# EAGLE design trackuino-icsp (EAGLE 5.08)
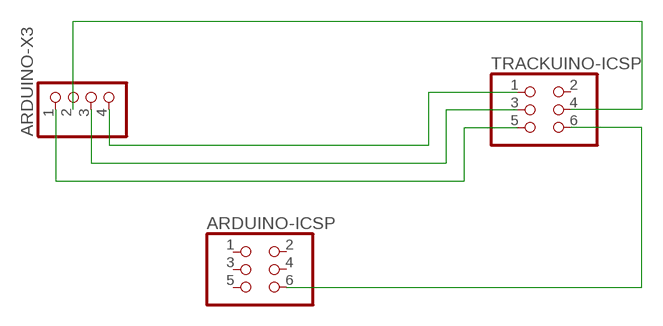
[diagram p0: schematic, sheet 1]

## Parts
ARDUINO-ICSP  PINHD-2X3  [2X03]
ARDUINO-X3  PINHD-1X4  [1X04]
TRACKUINO-ICSP  PINHD-2X3  [2X03]

## Nets
N$1: ARDUINO-X3.1 TRACKUINO-ICSP.5
N$2: ARDUINO-X3.2 TRACKUINO-ICSP.4
N$3: ARDUINO-X3.3 TRACKUINO-ICSP.3
N$4: ARDUINO-X3.4 TRACKUINO-ICSP.1
N$5: ARDUINO-ICSP.6 TRACKUINO-ICSP.6
Unconnected: ARDUINO-ICSP.1 ARDUINO-ICSP.2 ARDUINO-ICSP.3 ARDUINO-ICSP.4 ARDUINO-ICSP.5 TRACKUINO-ICSP.2

## Library data of the parts
ARDUINO-ICSP TRACKUINO-ICSP = pinhead:PINHD-2X3: PIN HEADER
ARDUINO-X3 = pinhead:PINHD-1X4: PIN HEADER

## Board
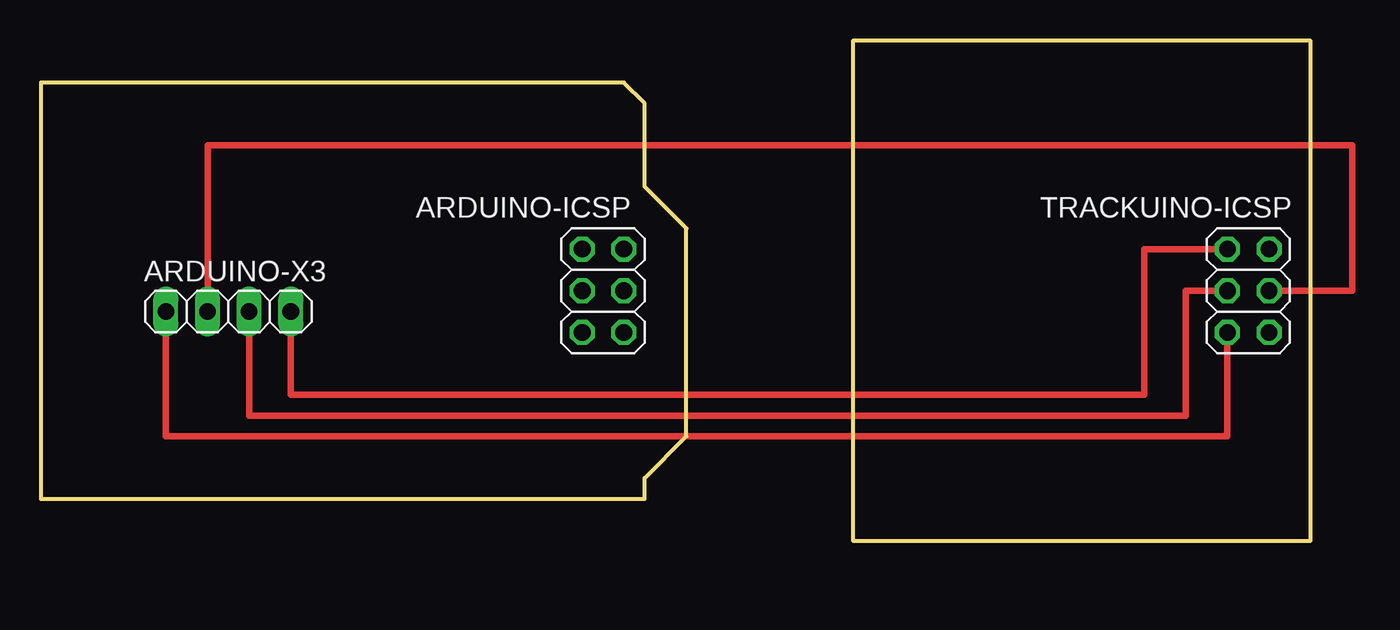
[diagram p1: board, top side]
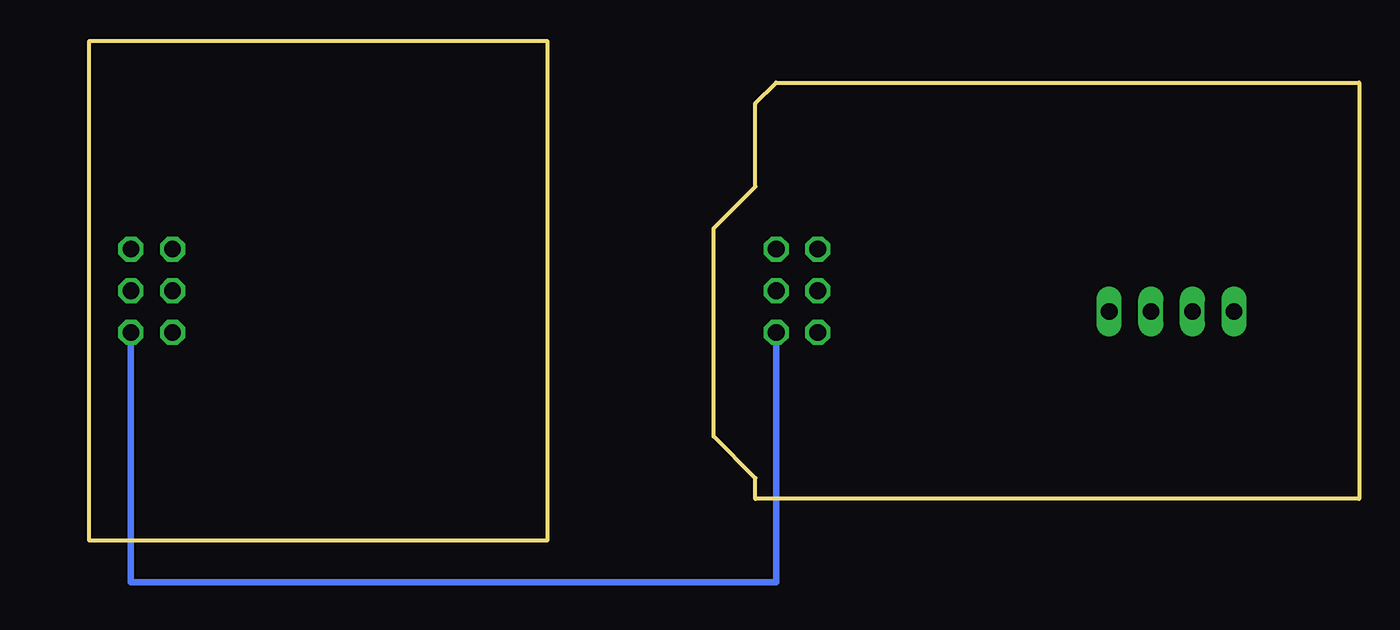
[diagram p2: board, bottom side, seen from below]

Size 77.47 x 30.48 mm. Coordinates in mm from the lower left corner, seen from the top.
Outline: 0,27.94 0,2.54 36.83,2.54 36.83,3.81 39.37,6.35 39.37,19.05 36.83,21.59 36.83,26.67 35.56,27.94 0,27.94
Outline: 49.53,30.48 49.53,0 77.47,0 77.47,30.48 49.53,30.48
Copper layers (1*16): Top 0.035mm / dielectric 1.5mm / Bottom 0.035mm
Design rules "default": minimum track width 10mil, minimum drill 24mil, track to track 8mil, track to pad 8mil, pad to pad 8mil, via to via 8mil, smd to smd 8mil, copper to edge 40mil, drill to drill 8mil, minimum pad ring 10mil, minimum via ring 8mil, stop-mask expansion 4mil, vias tented up to drill 0mil, thermal gap 10mil

### Footprints (pad centres in the part's own frame; a part is rotated, then mirrored left to right if it is on the bottom)
2X03 = drill 1.016 octagon: 1 -2.54,-1.27; 2 -2.54,1.27; 3 0,-1.27; 4 0,1.27; 5 2.54,-1.27; 6 2.54,1.27
1X04 = drill 1.016 long: 1 -3.81,0; 2 -1.27,0; 3 1.27,0; 4 3.81,0

### Placement (x,y rotation side)
ARDUINO-ICSP  34.29,15.24 270 top
ARDUINO-X3  11.43,13.97 0 top
TRACKUINO-ICSP  73.66,15.24 270 top

### Tracks (layer width: path | path; a pad name or v marks a point on that pad's centre or on a via)
N$1
  Top 0.406: ARDUINO-X3.1 7.62,6.35 72.39,6.35 TRACKUINO-ICSP.5
N$2
  Top 0.406: ARDUINO-X3.2 10.16,24.13 80.01,24.13 80.01,15.24 TRACKUINO-ICSP.4
N$3
  Top 0.406: ARDUINO-X3.3 12.7,7.62 69.85,7.62 69.85,15.24 TRACKUINO-ICSP.3
N$4
  Top 0.406: ARDUINO-X3.4 15.24,8.89 67.31,8.89 67.31,17.78 TRACKUINO-ICSP.1
N$5
  Bottom 0.406: ARDUINO-ICSP.6 35.56,-2.54 74.93,-2.54 TRACKUINO-ICSP.6